# Altium schematic sheet EJECTION_CIRCUIT.SchDoc
size B; SheetNumber: 2; SheetTotal: 10
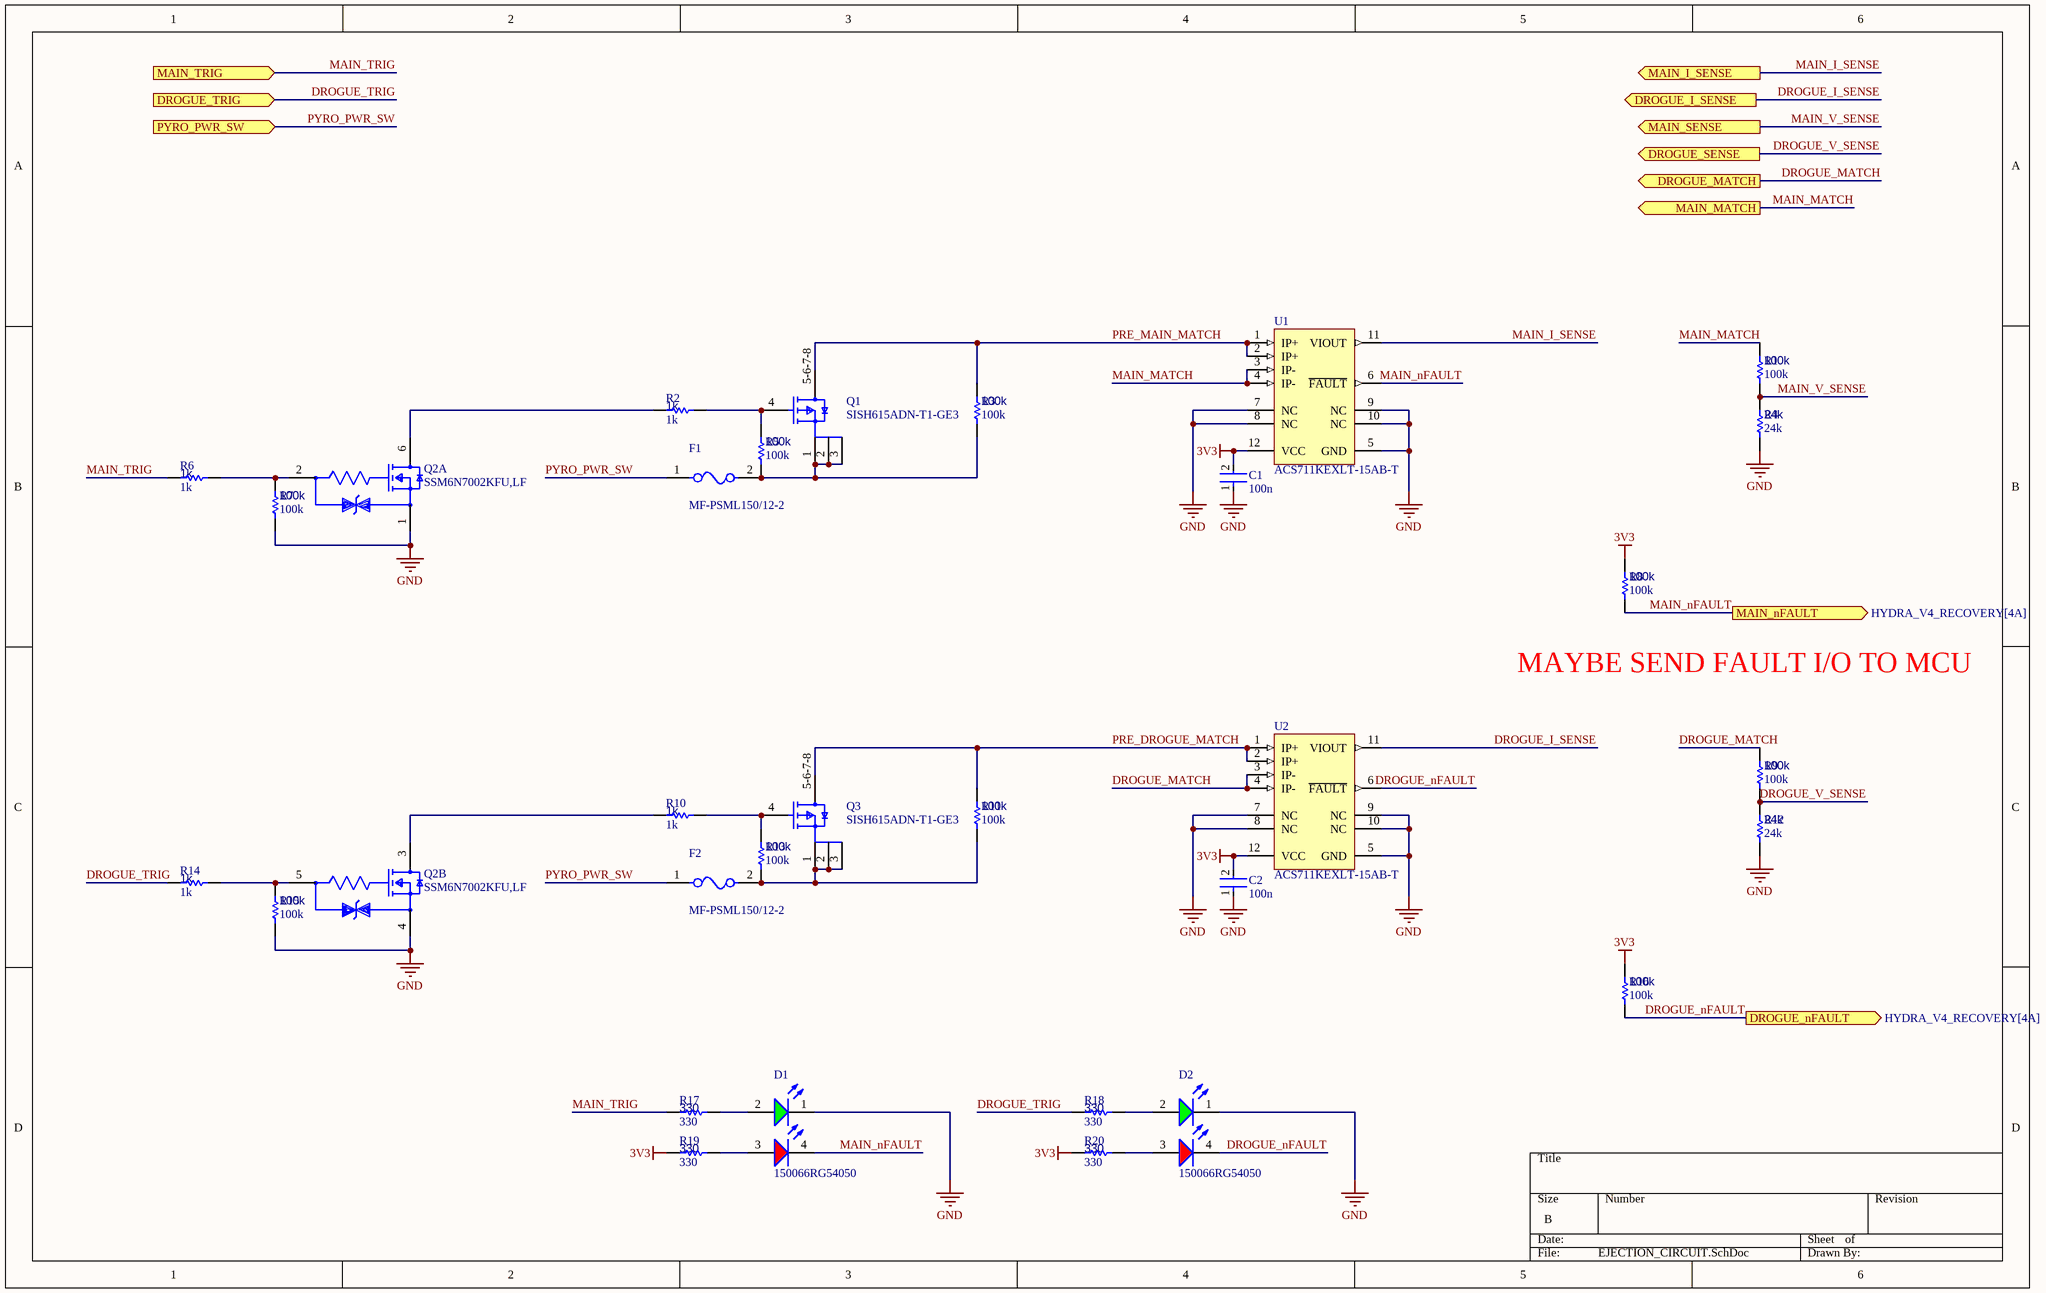
[diagram p0: EJECTION_CIRCUIT.SchDoc]

## Parts
C1  100n  [FP-0402-L_1_0_0_05-W_0_5-IPC_A]
C2  100n  [FP-0402-L_1_0_0_05-W_0_5-IPC_A]
D1  150066RG54050  [WL-SBCD_0606]
D2  150066RG54050  [WL-SBCD_0606]
F1  MF-PSML150/12-2  [FP-MF-PSMF-MFG]
F2  MF-PSML150/12-2  [FP-MF-PSMF-MFG]
Q1  SISH615ADN-T1-GE3  [SISH615ADN-T1-GE3-Footprint-1]
Q2  SSM6N7002KFU,LF  [FP-SSOP6-P-0_65A-MFG]  (parts A,B of 2)
Q3  SISH615ADN-T1-GE3  [SISH615ADN-T1-GE3-Footprint-1]
R1  100k  [R0603B]
R2  1k  [R0603B]
R3  100k  [R0603B]
R4  24k  [R0603B]
R5  100k  [R0603B]
R6  1k  [R0603B]
R7  100k  [R0603B]
R8  100k  [R0603B]
R9  100k  [R0603B]
R10  1k  [R0603B]
R11  100k  [R0603B]
R12  24k  [R0603B]
R13  100k  [R0603B]
R14  1k  [R0603B]
R15  100k  [R0603B]
R16  100k  [R0603B]
R17  330  [R0603B]
R18  330  [R0603B]
R19  330  [R0603B]
R20  330  [R0603B]
U1  ACS711KEXLT-15AB-T  [ALEG-EX-12_V]
U2  ACS711KEXLT-15AB-T  [ALEG-EX-12_V]

## Ports
DROGUE_I_SENSE (out, see HYDRA_V4_RECOVERY[4A]), DROGUE_MATCH (out, see HYDRA_V4_RECOVERY[4A]), DROGUE_nFAULT (out, see HYDRA_V4_RECOVERY[4A]), DROGUE_SENSE (out, see HYDRA_V4_RECOVERY[4A]), DROGUE_TRIG (in, see HYDRA_V4_RECOVERY[4A]), MAIN_I_SENSE (out, see HYDRA_V4_RECOVERY[4A]), MAIN_MATCH (out, see HYDRA_V4_RECOVERY[4A]), MAIN_nFAULT (out, see HYDRA_V4_RECOVERY[4A]), MAIN_SENSE (out, see HYDRA_V4_RECOVERY[4A]), MAIN_TRIG (in, see HYDRA_V4_RECOVERY[4A]), PYRO_PWR_SW (in, see HYDRA_V4_RECOVERY[4A])

## Nets
3V3: C1.2 C2.2 R8.2 R16.2 R19.2 R20.2 U1.12(VCC) U2.12(VCC)
GND: C1.1 C2.1 D1.1(K) D2.1(K) Q2.1(Source1) Q2.4(Source2) R4.1 R7.1 R12.1 R15.1 U1.5(GND) U1.7(NC) U1.8(NC) U1.9(NC) U1.10(NC) U2.5(GND) U2.7(NC) U2.8(NC) U2.9(NC) U2.10(NC)
DROGUE_I_SENSE: U2.11(VIOUT) ; port DROGUE_I_SENSE
DROGUE_MATCH: R9.2 U2.3(IP-) U2.4(IP-) ; port DROGUE_MATCH
DROGUE_nFAULT: D2.4(K) R16.1 U2.6(~{FAULT}) ; port DROGUE_nFAULT
DROGUE_TRIG: R14.2 R18.2 ; port DROGUE_TRIG
DROGUE_V_SENSE: R9.1 R12.2 ; port DROGUE_SENSE
MAIN_I_SENSE: U1.11(VIOUT) ; port MAIN_I_SENSE
MAIN_MATCH: R1.2 U1.3(IP-) U1.4(IP-) ; port MAIN_MATCH
MAIN_nFAULT: D1.4(K) R8.1 U1.6(~{FAULT}) ; port MAIN_nFAULT
MAIN_TRIG: R6.2 R17.2 ; port MAIN_TRIG
MAIN_V_SENSE: R1.1 R4.2 ; port MAIN_SENSE
PRE_DROGUE_MATCH: Q3.5-6-7-8(D) R11.2 U2.1(IP+) U2.2(IP+)
PRE_MAIN_MATCH: Q1.5-6-7-8(D) R3.2 U1.1(IP+) U1.2(IP+)
PYRO_PWR_SW: F1.1 F2.1 ; port PYRO_PWR_SW
NetD1_2: D1.2(A) R17.1
NetD1_3: D1.3(A) R19.1
NetD2_2: D2.2(A) R18.1
NetD2_3: D2.3(A) R20.1
NetF1_2: F1.2 Q1.1(S) Q1.2(S) Q1.3(S) R3.1 R5.1
NetF2_2: F2.2 Q3.1(S) Q3.2(S) Q3.3(S) R11.1 R13.1
NetQ1_4: Q1.4(G) R2.1 R5.2
NetQ2_2: Q2.2(Gate1) R6.1 R7.2
NetQ2_3: Q2.3(Drain2) R10.2
NetQ2_5: Q2.5(Gate2) R14.1 R15.2
NetQ2_6: Q2.6(Drain1) R2.2
NetQ3_4: Q3.4(G) R10.1 R13.2

## Notes on the sheet
- (near R8) MAYBE SEND FAULT I/O TO MCU

## Library data of the parts
C1 C2 = CMP-001-00058-1: LARGE PADS, 0402 CAP, CHANGE COMMENT TO MATCH REAL P/N; Capacitor Type: Ceramic; Value: 100n; Min Operating Temperature: -55°C; Mounting Technology: Surface Mount; Pins: 2; Case/Package: 0402; RoHS Compliant: Yes; Max Operating Temperature: 85°C
D1 D2 = CMP-004-00040-2: Led, Red/Grn, 180Mcd/230Mcd, 624Nm/525Nm Rohs Compliant: Yes; Source: rgled.SchLib; Component Type: Standard; Design Item ID: CMP-004-00034-2; Pins: 4
F1 F2 = CMP-07400-000017-1: Manufacturer Part Number: MF-PSMF010X-2; Manufacturer: Bourns Inc.; Resistance: 1-7.5Ω; Value: 1-7.5Ω; Current Rating: 40A; Hold Current: 0.1A; Trip Current: 0.3A; Voltage Rating: 15V; Trip Time: 1.5s; Temperature: -40°C to +85°C; ComponentLink2Description: Datasheet; Lead Free: Yes; Ipc Land Pattern Name: CAPC215135X67; Device Class L1: Circuit Protection; Mouser Description: Resettable Fuses - PPTC 0.10A 15V 1ohm; Automotive: No; Octopart: https://octopart.com/mf-psmf010x-2-bourns-7483441; RoHS: TRUE; Temperature Range High: +85°C; Digikey Description: PTC RESET FUSE 15V 100MA 0805; Device Class L3: unset; ComponentLink2URL: https://www.bourns.com/docs/Product-Datasheets/mfpsmf.pdf; Height: 0.85mm; Ambient Temperature Range Low: -40°C; Category: Fuse; Package: MF-PSMF; Temperature Range Low: -40°C; Device Class L2: PTC Resettable Fuses; Ambient Temperature Range High: +85°C
Q1 Q3 = CMP-013-00018-2: Trans MOSFET P-CH 20V 22.1A 8-Pin PowerPAK 1212 EP T/R; Source: SISH615ADN-T1-GE3.SchLib; Design Item ID: CMP-013-00036-4; Component Type: Standard; Pins: 5
Q2 = CMP-35916-000009-1: MOSFET 2N-CH 60V 0.3A; Input Capacitance: 40pF; Continuous Drain Current (ID): 300mA; Max Power Dissipation: 285mW; FET Type: 2 N-Channel; Rds On Max: 1.5R; Mount: Surface Mount; Drain to Source Voltage (Vdss): 60V; Packaging: Tape and Reel
R1-R20 = CMP-009-00002-14: Resistor
  R1 R3 R5 R7-R9 R11 R13 R15 R16: Value: 100k
  R2 R6 R10 R14: Value: 1k
  R4 R12: Value: 24k
  R17-R20: Value: 330
U1 U2 = CMP-1557-00001-1: Hall Effect Linear Current Sensor with Overcurrent Fault Output for <100 V Isolation Applications, 3 to 5.5 V, -15.5 to 15.5 A IP, -40 to 125 degC, 12-Pin QFN (EX), RoHS, Tape and Reel; VCC Max: 5.5 V; IP Max: 15.5 A; VCC Min: 3 V; IP Min: -15.5 A; -3dB Bandwidth: 0.1 MHz; PackageDescription: 12-Pin Quad Flat No-Lead, Body 3 x 3 mm, Height 0.8 mm; ComponentLink1URL: http://www.allegromicro.com/; Packing: Tape and Reel; ComponentLink2URL: http://www.allegromicro.com/~/media/Files/Datasheets/ACS711-Datasheet.ashx?la=en; DatasheetVersion: Rev. 3; PartNumber: ACS711KEXLT-15AB-T; ComponentLink2Description: Datasheet; ComponentLink3URL: http://www.allegromicro.com/~/media/Files/Datasheets/ACS711-Datasheet.ashx?la=en; RoHS: TRUE; ComponentLink1Description: Manufacturer URL; ComponentLink3Description: Package Specification; Temperature Max: 125 degC; Mounting Technology: Surface Mount; Temperature Min: -40 degC